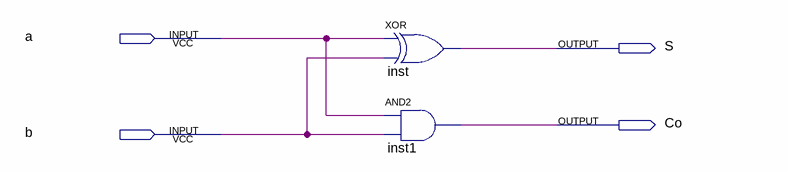
[diagram p0: schematic sheet]
// Quartus schematic half_adder.bdf as structural Verilog: 2 symbols, 4 pins
module half_adder (
  input  a,
  input  b,
  output S,
  output Co
);

  xor inst (S, a, b);
  and inst1 (Co, a, b);
endmodule
